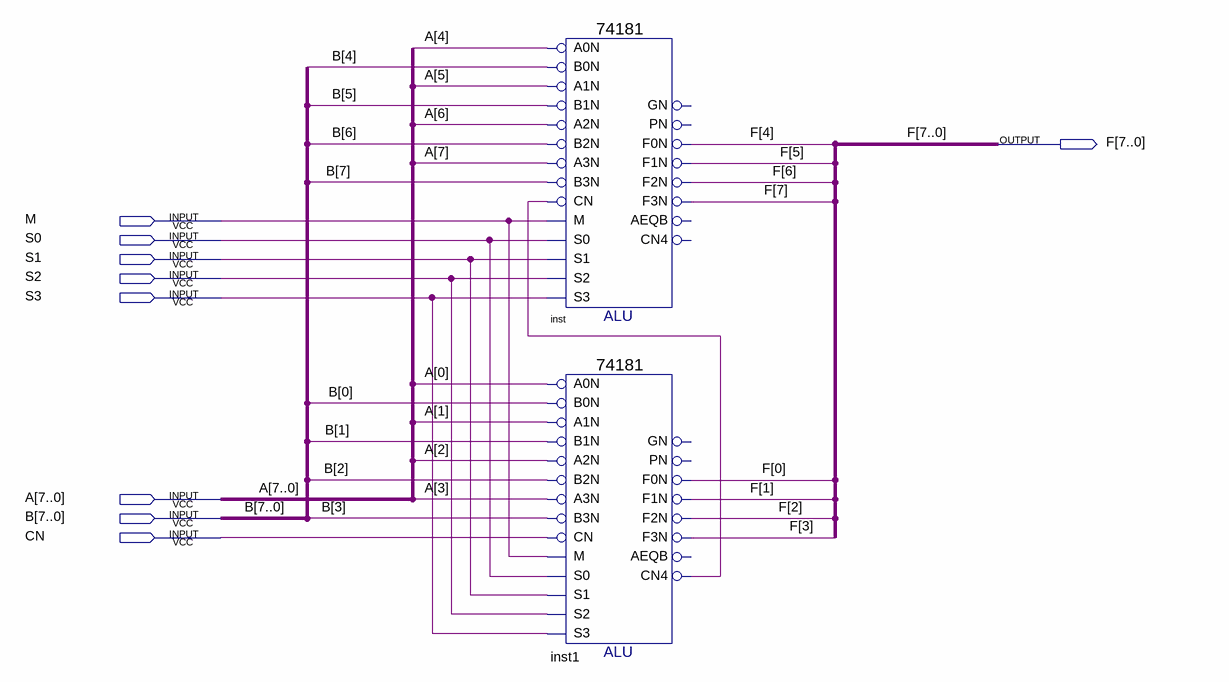
[diagram p0: schematic sheet]
// Quartus schematic ALU.bdf as structural Verilog: 2 symbols, 9 pins
module ALU (
  input  M,
  input  S0,
  input  S1,
  input  S2,
  input  S3,
  input  [7:0] A,
  input  [7:0] B,
  input  CN,
  output [7:0] F
);

  wire inst1_cn4;

  \74181  inst (
    .B0N(B[4]), .A0N(A[4]), .A1N(A[5]), .B1N(B[5]), .A3N(A[7]), .B2N(B[6]), .A2N(A[6]), .M(M),
    .CN(inst1_cn4), .B3N(B[7]), .S2(S2), .S1(S1), .S0(S0), .S3(S3), .F3N(F[7]), .F1N(F[5]), .F0N(F[4]),
    .F2N(F[6]));  // open: PN, GN, AEQB, CN4
  \74181  inst1 (
    .B0N(B[0]), .A0N(A[0]), .A1N(A[1]), .B1N(B[1]), .A3N(A[3]), .B2N(B[2]), .A2N(A[2]), .M(M), .CN(CN),
    .B3N(B[3]), .S2(S2), .S1(S1), .S0(S0), .S3(S3), .F3N(F[3]), .F1N(F[1]), .F0N(F[0]), .CN4(inst1_cn4),
    .F2N(F[2]));  // open: PN, GN, AEQB
endmodule
